# Altium project ATmega324PB_Xplained_Pro.PrjPCB (part 2 of 2)
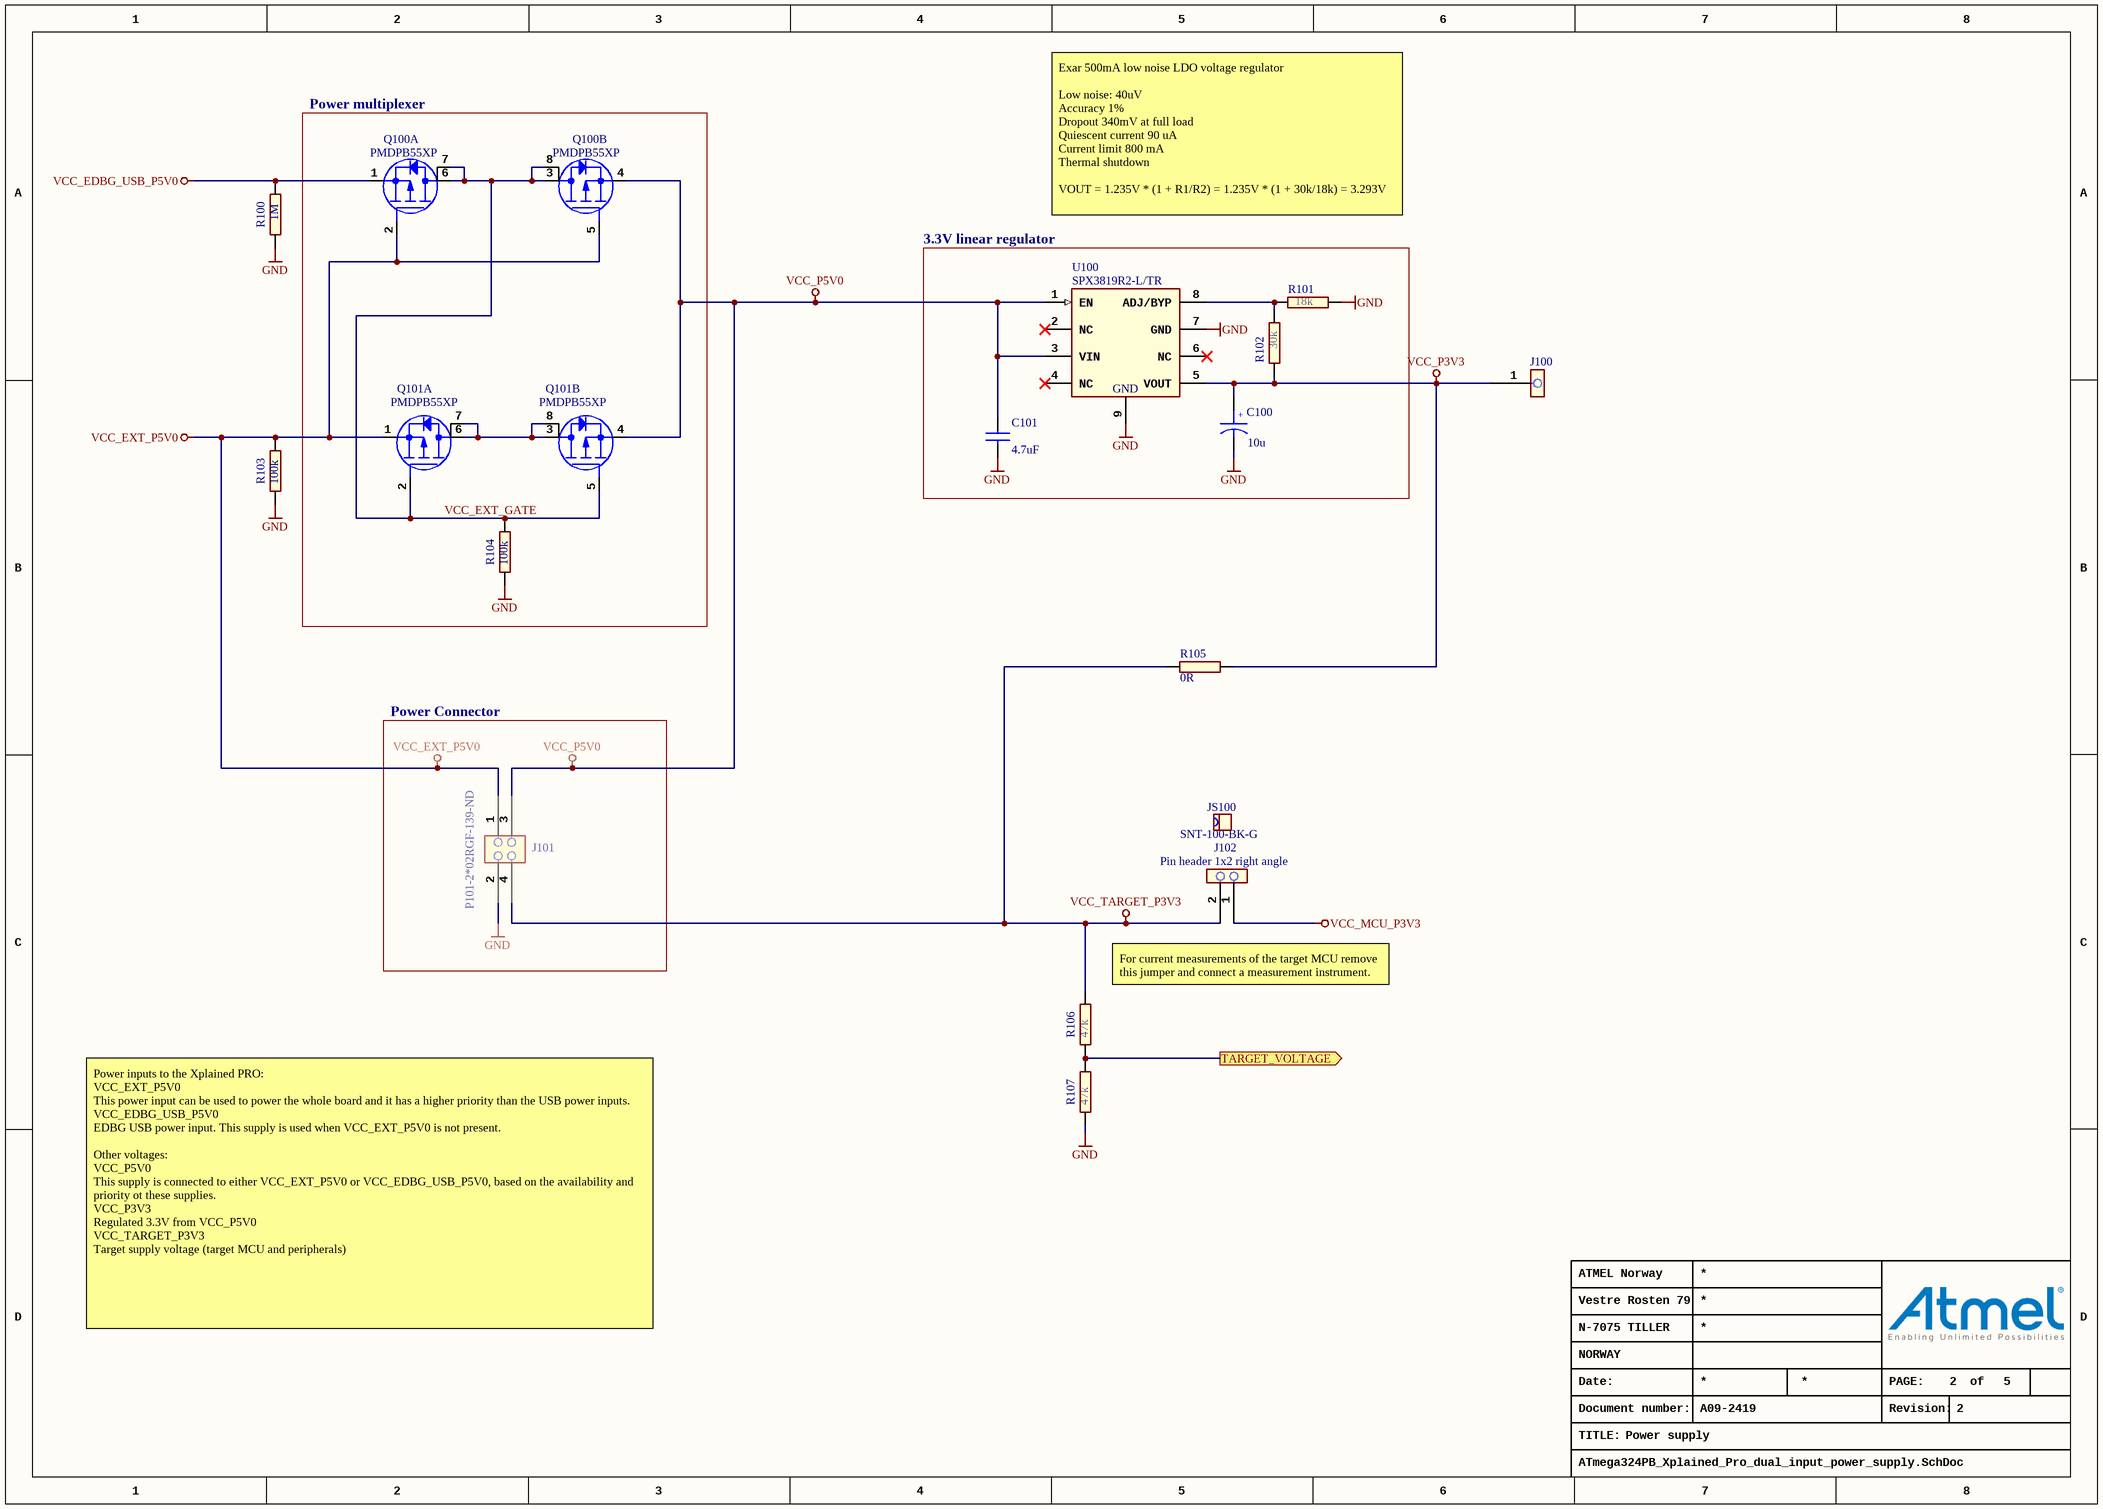
[diagram p5: ATmega324PB_Xplained_Pro_dual_input_power_supply.SchDoc]

## Assembly variants
Default_assembly: not fitted C207 C208 C403 J100 J200 J303 J305 R421 XC201